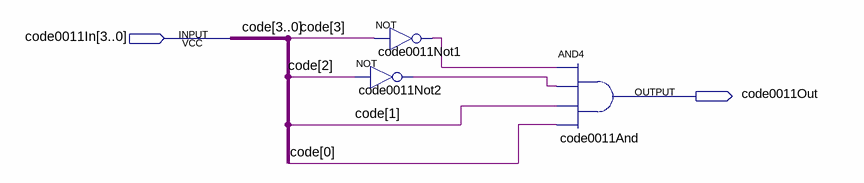
[diagram p0: schematic sheet]
// Quartus schematic code0011.bdf as structural Verilog: 3 symbols, 2 pins
module code0011 (
  input  [3:0] code0011In,
  output code0011Out
);

  wire code0011Not1_out, code0011Not2_out;

  not code0011Not1 (code0011Not1_out, code0011In[3]);
  not code0011Not2 (code0011Not2_out, code0011In[2]);
  and code0011And (code0011Out, code0011Not1_out, code0011Not2_out, code0011In[1], code0011In[0]);

  // Other names for the same wires on the sheet: code[3:0] = code0011In
endmodule
